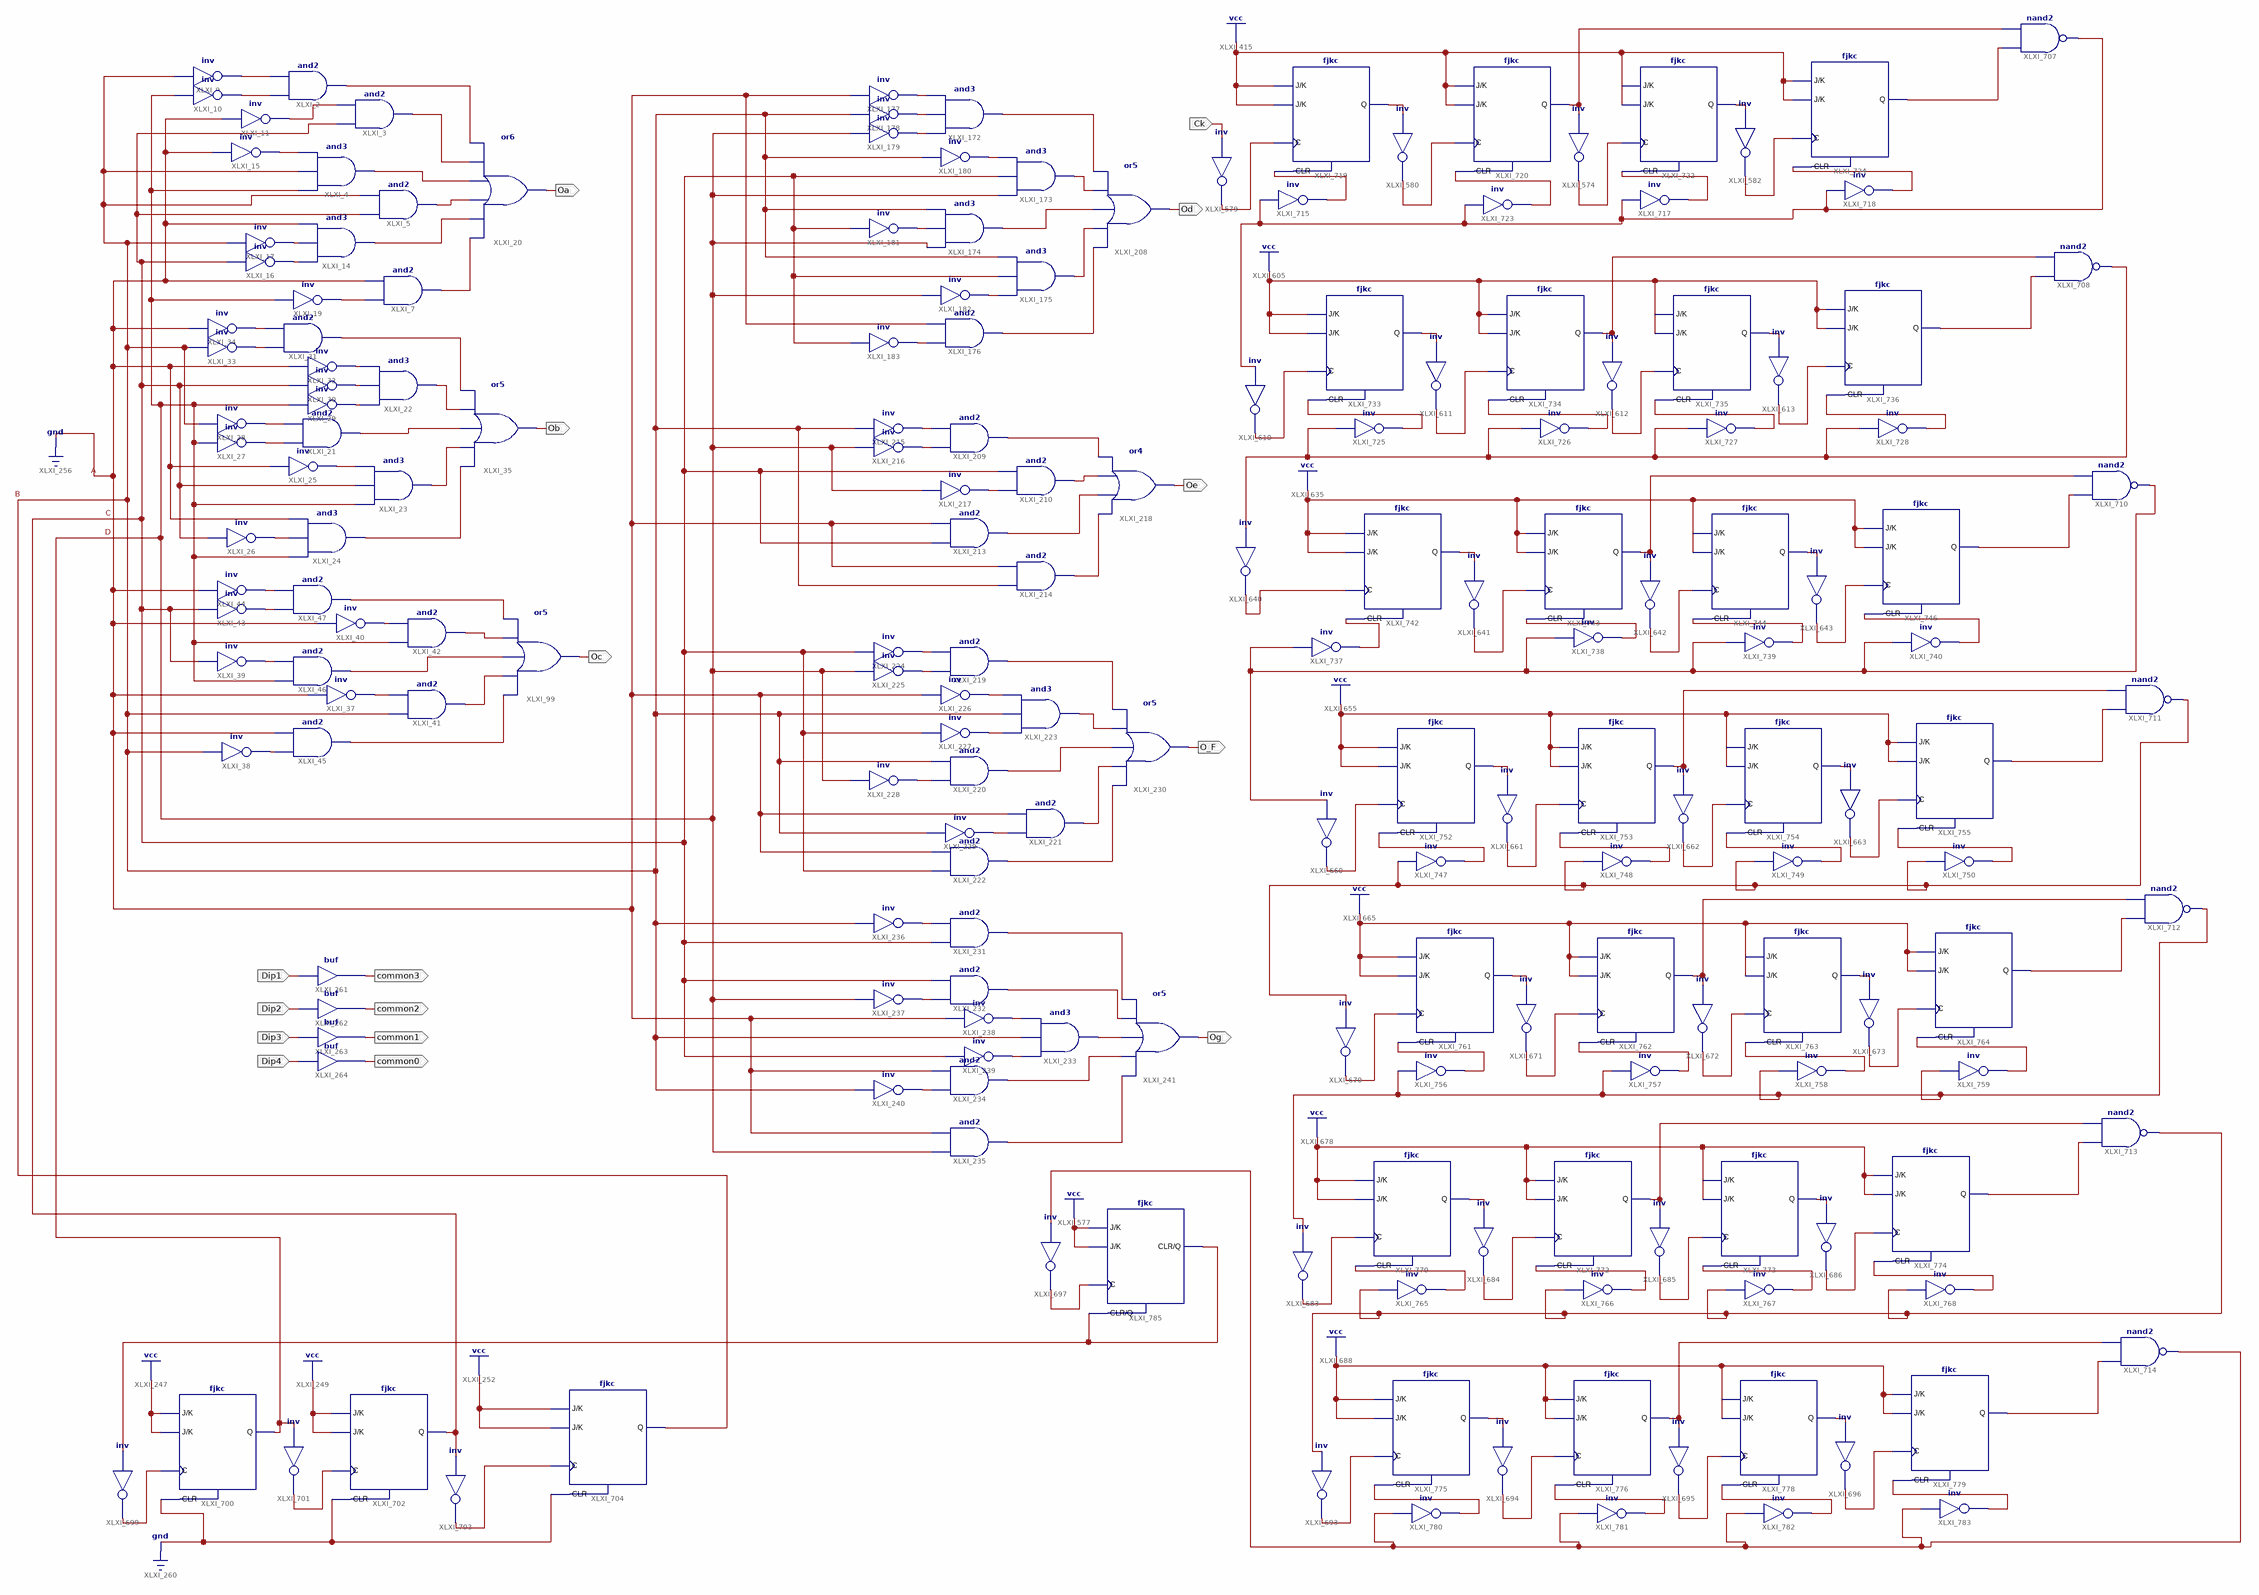
[diagram p0: schematic sheet 1]
// Xilinx ISE schematic lab8test.sch (spartan6) as structural Verilog: 188 symbols, 16 ports
module lab8test (
  input  Dip1,
  input  Dip2,
  input  Dip3,
  input  Dip4,
  input  Ck,
  output Oa,
  output Ob,
  output Oc,
  output Od,
  output Oe,
  output O_F,
  output Og,
  output common3,
  output common2,
  output common1,
  output common0
);

  wire B, C, clk1, D, XLXN_1, XLXN_2, XLXN_3, XLXN_4, XLXN_5, XLXN_6, XLXN_7, XLXN_8, XLXN_9, XLXN_10,
       XLXN_11, XLXN_12, XLXN_13, XLXN_14, XLXN_15, XLXN_17, XLXN_18, XLXN_19, XLXN_20, XLXN_21, XLXN_22,
       XLXN_23, XLXN_24, XLXN_25, XLXN_26, XLXN_27, XLXN_28, XLXN_49, XLXN_50, XLXN_51, XLXN_52, XLXN_53,
       XLXN_54, XLXN_113, XLXN_115, XLXN_116, XLXN_117, XLXN_118, XLXN_215, XLXN_216, XLXN_217, XLXN_218,
       XLXN_219, XLXN_220, XLXN_221, XLXN_249, XLXN_250, XLXN_251, XLXN_252, XLXN_253, XLXN_255, XLXN_256,
       XLXN_257, XLXN_263, XLXN_264, XLXN_265, XLXN_266, XLXN_268, XLXN_269, XLXN_270, XLXN_271, XLXN_272,
       XLXN_273, XLXN_279, XLXN_280, XLXN_281, XLXN_282, XLXN_283, XLXN_285, XLXN_286, XLXN_287, XLXN_288,
       XLXN_289, XLXN_300, XLXN_301, XLXN_302, XLXN_303, XLXN_304, XLXN_566, XLXN_790, XLXN_792, XLXN_795,
       XLXN_796, XLXN_797, XLXN_826, XLXN_830, XLXN_831, XLXN_835, XLXN_836, XLXN_837, XLXN_869, XLXN_871,
       XLXN_873, XLXN_874, XLXN_878, XLXN_879, XLXN_880, XLXN_898, XLXN_900, XLXN_902, XLXN_903, XLXN_907,
       XLXN_908, XLXN_909, XLXN_911, XLXN_915, XLXN_916, XLXN_920, XLXN_921, XLXN_922, XLXN_925, XLXN_929,
       XLXN_930, XLXN_934, XLXN_935, XLXN_936, XLXN_940, XLXN_944, XLXN_945, XLXN_949, XLXN_950, XLXN_951,
       XLXN_952, XLXN_954, XLXN_957, XLXN_958, XLXN_961, XLXN_963, XLXN_964, XLXN_965, XLXN_966, XLXN_967,
       XLXN_968, XLXN_969, XLXN_970, XLXN_971, XLXN_972, XLXN_973, XLXN_974, XLXN_975, XLXN_977, XLXN_982,
       XLXN_985, XLXN_986, XLXN_987, XLXN_988, XLXN_989, XLXN_990, XLXN_991, XLXN_994, XLXN_995, XLXN_996,
       XLXN_997, XLXN_1001, XLXN_1002, XLXN_1003, XLXN_1004, XLXN_1006, XLXN_1010, XLXN_1013, XLXN_1014,
       XLXN_1016, XLXN_1017, XLXN_1019, XLXN_1023, XLXN_1024, XLXN_1026, XLXN_1027, XLXN_1029, XLXN_1031,
       XLXN_1033, XLXN_1035, XLXN_1036;

  and XLXI_2 (XLXN_8, XLXN_2, XLXN_1);
  and XLXI_3 (XLXN_9, C, XLXN_3);
  not XLXI_9 (XLXN_1, B);
  not XLXI_10 (XLXN_2, D);
  not XLXI_11 (XLXN_3, 1'b0);
  and XLXI_4 (XLXN_10, D, B, XLXN_4);
  and XLXI_5 (XLXN_11, C, B);
  and XLXI_14 (XLXN_12, XLXN_6, XLXN_5, 1'b0);
  not XLXI_15 (XLXN_4, 1'b0);
  not XLXI_16 (XLXN_6, C);
  not XLXI_17 (XLXN_5, B);
  and XLXI_7 (XLXN_13, XLXN_7, 1'b0);
  not XLXI_19 (XLXN_7, D);
  or XLXI_20 (Oa, XLXN_13, XLXN_12, XLXN_11, XLXN_10, XLXN_9, XLXN_8);
  and XLXI_21 (XLXN_26, XLXN_18, XLXN_19);
  and XLXI_22 (XLXN_25, XLXN_20, XLXN_21, XLXN_22);
  and XLXI_23 (XLXN_27, D, C, XLXN_17);
  and XLXI_24 (XLXN_28, D, XLXN_23, 1'b0);
  not XLXI_25 (XLXN_17, 1'b0);
  not XLXI_26 (XLXN_23, C);
  not XLXI_27 (XLXN_18, D);
  not XLXI_28 (XLXN_19, B);
  not XLXI_29 (XLXN_20, D);
  not XLXI_30 (XLXN_21, C);
  and XLXI_31 (XLXN_24, XLXN_15, XLXN_14);
  not XLXI_32 (XLXN_22, 1'b0);
  not XLXI_33 (XLXN_15, B);
  not XLXI_34 (XLXN_14, 1'b0);
  or XLXI_35 (Ob, XLXN_28, XLXN_27, XLXN_26, XLXN_25, XLXN_24);
  or XLXI_99 (Oc, XLXN_118, XLXN_117, XLXN_116, XLXN_115, XLXN_113);
  not XLXI_37 (XLXN_50, 1'b0);
  not XLXI_38 (XLXN_49, B);
  not XLXI_39 (XLXN_51, C);
  not XLXI_40 (XLXN_52, 1'b0);
  and XLXI_41 (XLXN_117, B, XLXN_50);
  and XLXI_42 (XLXN_115, D, XLXN_52);
  not XLXI_43 (XLXN_53, C);
  not XLXI_44 (XLXN_54, 1'b0);
  and XLXI_45 (XLXN_118, XLXN_49, 1'b0);
  and XLXI_46 (XLXN_116, D, XLXN_51);
  and XLXI_47 (XLXN_113, XLXN_53, XLXN_54);
  and XLXI_172 (XLXN_249, XLXN_219, XLXN_220, XLXN_221);
  and XLXI_173 (XLXN_250, D, C, XLXN_218);
  and XLXI_174 (XLXN_251, D, XLXN_217, B);
  and XLXI_175 (XLXN_252, XLXN_216, C, B);
  and XLXI_176 (XLXN_253, XLXN_215, 1'b0);
  not XLXI_177 (XLXN_221, 1'b0);
  not XLXI_178 (XLXN_220, B);
  not XLXI_179 (XLXN_219, D);
  not XLXI_180 (XLXN_218, B);
  not XLXI_181 (XLXN_217, C);
  not XLXI_182 (XLXN_216, D);
  not XLXI_183 (XLXN_215, C);
  or XLXI_208 (Od, XLXN_253, XLXN_252, XLXN_251, XLXN_250, XLXN_249);
  and XLXI_209 (XLXN_263, XLXN_256, XLXN_255);
  and XLXI_210 (XLXN_264, XLXN_257, C);
  and XLXI_213 (XLXN_265, C, 1'b0);
  and XLXI_214 (XLXN_266, B, 1'b0);
  not XLXI_215 (XLXN_255, B);
  not XLXI_216 (XLXN_256, D);
  not XLXI_217 (XLXN_257, D);
  or XLXI_218 (Oe, XLXN_266, XLXN_265, XLXN_264, XLXN_263);
  and XLXI_219 (XLXN_279, XLXN_269, XLXN_268);
  and XLXI_220 (XLXN_281, XLXN_272, B);
  and XLXI_221 (XLXN_282, XLXN_273, 1'b0);
  and XLXI_222 (XLXN_283, C, 1'b0);
  and XLXI_223 (XLXN_280, XLXN_271, B, XLXN_270);
  not XLXI_224 (XLXN_268, C);
  not XLXI_225 (XLXN_269, D);
  not XLXI_226 (XLXN_270, 1'b0);
  not XLXI_227 (XLXN_271, C);
  not XLXI_228 (XLXN_272, D);
  not XLXI_229 (XLXN_273, B);
  or XLXI_230 (O_F, XLXN_283, XLXN_282, XLXN_281, XLXN_280, XLXN_279);
  and XLXI_231 (XLXN_301, C, XLXN_289);
  and XLXI_232 (XLXN_302, XLXN_288, C);
  and XLXI_233 (XLXN_300, XLXN_286, B, XLXN_285);
  and XLXI_234 (XLXN_303, XLXN_287, 1'b0);
  and XLXI_235 (XLXN_304, D, 1'b0);
  not XLXI_236 (XLXN_289, B);
  not XLXI_237 (XLXN_288, D);
  not XLXI_238 (XLXN_285, 1'b0);
  not XLXI_239 (XLXN_286, C);
  not XLXI_240 (XLXN_287, B);
  or XLXI_241 (Og, XLXN_304, XLXN_303, XLXN_300, XLXN_302, XLXN_301);
  buf XLXI_261 (common3, Dip1);
  buf XLXI_262 (common2, Dip2);
  buf XLXI_263 (common1, Dip3);
  buf XLXI_264 (common0, Dip4);
  not XLXI_579 (XLXN_790, Ck);
  not XLXI_580 (XLXN_792, XLXN_961);
  not XLXI_574 (XLXN_795, XLXN_963);
  not XLXI_582 (XLXN_797, XLXN_796);
  not XLXI_610 (XLXN_830, XLXN_987);
  not XLXI_611 (XLXN_831, XLXN_964);
  not XLXI_612 (XLXN_835, XLXN_965);
  not XLXI_613 (XLXN_837, XLXN_836);
  not XLXI_641 (XLXN_874, XLXN_966);
  not XLXI_642 (XLXN_878, XLXN_967);
  not XLXI_643 (XLXN_880, XLXN_879);
  not XLXI_640 (XLXN_873, XLXN_871);
  not XLXI_660 (XLXN_902, XLXN_900);
  not XLXI_661 (XLXN_903, XLXN_968);
  not XLXI_662 (XLXN_907, XLXN_969);
  not XLXI_663 (XLXN_909, XLXN_908);
  not XLXI_670 (XLXN_915, XLXN_1001);
  not XLXI_671 (XLXN_916, XLXN_970);
  not XLXI_672 (XLXN_920, XLXN_971);
  not XLXI_673 (XLXN_922, XLXN_921);
  not XLXI_683 (XLXN_929, XLXN_1016);
  not XLXI_684 (XLXN_930, XLXN_972);
  not XLXI_685 (XLXN_934, XLXN_973);
  not XLXI_686 (XLXN_936, XLXN_935);
  not XLXI_693 (XLXN_944, XLXN_1027);
  not XLXI_694 (XLXN_945, XLXN_974);
  not XLXI_695 (XLXN_949, XLXN_975);
  not XLXI_696 (XLXN_951, XLXN_950);
  not XLXI_697 (XLXN_952, XLXN_1036);
  fjkc XLXI_700 (.C(XLXN_958), .CLR(1'b0), .J(1'b1), .K(1'b1), .Q(D));
  not XLXI_701 (XLXN_954, D);
  fjkc XLXI_702 (.C(XLXN_954), .CLR(1'b0), .J(1'b1), .K(1'b1), .Q(C));
  not XLXI_703 (XLXN_957, C);
  fjkc XLXI_704 (.C(XLXN_957), .CLR(1'b0), .J(1'b1), .K(1'b1), .Q(B));
  not XLXI_699 (XLXN_958, clk1);
  nand XLXI_707 (XLXN_987, XLXN_566, XLXN_963);
  nand XLXI_708 (XLXN_871, XLXN_826, XLXN_965);
  nand XLXI_710 (XLXN_900, XLXN_869, XLXN_967);
  nand XLXI_711 (XLXN_1001, XLXN_898, XLXN_969);
  nand XLXI_712 (XLXN_1016, XLXN_911, XLXN_971);
  nand XLXI_713 (XLXN_1027, XLXN_925, XLXN_973);
  nand XLXI_714 (XLXN_1036, XLXN_940, XLXN_975);
  not XLXI_718 (XLXN_986, XLXN_987);
  not XLXI_715 (XLXN_977, XLXN_987);
  fjkc XLXI_719 (.C(XLXN_790), .CLR(XLXN_977), .J(1'b1), .K(1'b1), .Q(XLXN_961));
  fjkc XLXI_720 (.C(XLXN_792), .CLR(XLXN_982), .J(1'b1), .K(1'b1), .Q(XLXN_963));
  fjkc XLXI_722 (.C(XLXN_795), .CLR(XLXN_985), .J(1'b1), .K(1'b1), .Q(XLXN_796));
  not XLXI_723 (XLXN_982, XLXN_987);
  not XLXI_717 (XLXN_985, XLXN_987);
  fjkc XLXI_724 (.C(XLXN_797), .CLR(XLXN_986), .J(1'b1), .K(1'b1), .Q(XLXN_566));
  not XLXI_725 (XLXN_988, XLXN_871);
  not XLXI_726 (XLXN_989, XLXN_871);
  not XLXI_727 (XLXN_990, XLXN_871);
  not XLXI_728 (XLXN_991, XLXN_871);
  fjkc XLXI_733 (.C(XLXN_830), .CLR(XLXN_988), .J(1'b1), .K(1'b1), .Q(XLXN_964));
  fjkc XLXI_734 (.C(XLXN_831), .CLR(XLXN_989), .J(1'b1), .K(1'b1), .Q(XLXN_965));
  fjkc XLXI_735 (.C(XLXN_835), .CLR(XLXN_990), .J(1'b1), .K(1'b1), .Q(XLXN_836));
  fjkc XLXI_736 (.C(XLXN_837), .CLR(XLXN_991), .J(1'b1), .K(1'b1), .Q(XLXN_826));
  not XLXI_738 (XLXN_995, XLXN_900);
  not XLXI_739 (XLXN_996, XLXN_900);
  not XLXI_740 (XLXN_997, XLXN_900);
  fjkc XLXI_742 (.C(XLXN_873), .CLR(XLXN_994), .J(1'b1), .K(1'b1), .Q(XLXN_966));
  fjkc XLXI_743 (.C(XLXN_874), .CLR(XLXN_995), .J(1'b1), .K(1'b1), .Q(XLXN_967));
  fjkc XLXI_744 (.C(XLXN_878), .CLR(XLXN_996), .J(1'b1), .K(1'b1), .Q(XLXN_879));
  fjkc XLXI_746 (.C(XLXN_880), .CLR(XLXN_997), .J(1'b1), .K(1'b1), .Q(XLXN_869));
  not XLXI_737 (XLXN_994, XLXN_900);
  not XLXI_747 (XLXN_1002, XLXN_1001);
  not XLXI_748 (XLXN_1003, XLXN_1001);
  not XLXI_749 (XLXN_1004, XLXN_1001);
  not XLXI_750 (XLXN_1006, XLXN_1001);
  fjkc XLXI_752 (.C(XLXN_902), .CLR(XLXN_1002), .J(1'b1), .K(1'b1), .Q(XLXN_968));
  fjkc XLXI_753 (.C(XLXN_903), .CLR(XLXN_1003), .J(1'b1), .K(1'b1), .Q(XLXN_969));
  fjkc XLXI_754 (.C(XLXN_907), .CLR(XLXN_1004), .J(1'b1), .K(1'b1), .Q(XLXN_908));
  fjkc XLXI_755 (.C(XLXN_909), .CLR(XLXN_1006), .J(1'b1), .K(1'b1), .Q(XLXN_898));
  not XLXI_757 (XLXN_1013, XLXN_1016);
  not XLXI_758 (XLXN_1014, XLXN_1016);
  fjkc XLXI_761 (.C(XLXN_915), .CLR(XLXN_1010), .J(1'b1), .K(1'b1), .Q(XLXN_970));
  fjkc XLXI_762 (.C(XLXN_916), .CLR(XLXN_1013), .J(1'b1), .K(1'b1), .Q(XLXN_971));
  fjkc XLXI_763 (.C(XLXN_920), .CLR(XLXN_1014), .J(1'b1), .K(1'b1), .Q(XLXN_921));
  fjkc XLXI_764 (.C(XLXN_922), .CLR(XLXN_1017), .J(1'b1), .K(1'b1), .Q(XLXN_911));
  not XLXI_756 (XLXN_1010, XLXN_1016);
  not XLXI_759 (XLXN_1017, XLXN_1016);
  not XLXI_765 (XLXN_1019, XLXN_1027);
  not XLXI_766 (XLXN_1023, XLXN_1027);
  not XLXI_767 (XLXN_1024, XLXN_1027);
  not XLXI_768 (XLXN_1026, XLXN_1027);
  fjkc XLXI_770 (.C(XLXN_929), .CLR(XLXN_1019), .J(1'b1), .K(1'b1), .Q(XLXN_972));
  fjkc XLXI_772 (.C(XLXN_930), .CLR(XLXN_1023), .J(1'b1), .K(1'b1), .Q(XLXN_973));
  fjkc XLXI_773 (.C(XLXN_934), .CLR(XLXN_1024), .J(1'b1), .K(1'b1), .Q(XLXN_935));
  fjkc XLXI_774 (.C(XLXN_936), .CLR(XLXN_1026), .J(1'b1), .K(1'b1), .Q(XLXN_925));
  fjkc XLXI_775 (.C(XLXN_944), .CLR(XLXN_1029), .J(1'b1), .K(1'b1), .Q(XLXN_974));
  fjkc XLXI_776 (.C(XLXN_945), .CLR(XLXN_1031), .J(1'b1), .K(1'b1), .Q(XLXN_975));
  fjkc XLXI_778 (.C(XLXN_949), .CLR(XLXN_1033), .J(1'b1), .K(1'b1), .Q(XLXN_950));
  fjkc XLXI_779 (.C(XLXN_951), .CLR(XLXN_1035), .J(1'b1), .K(1'b1), .Q(XLXN_940));
  not XLXI_780 (XLXN_1029, XLXN_1036);
  not XLXI_781 (XLXN_1031, XLXN_1036);
  not XLXI_782 (XLXN_1033, XLXN_1036);
  not XLXI_783 (XLXN_1035, XLXN_1036);
  fjkc XLXI_785 (.C(XLXN_952), .CLR(clk1), .J(1'b1), .K(1'b1), .Q(clk1));
endmodule
